# Altium schematic sheet usb-to-uart.SchDoc
size 420 x 297 mm; Address1: Address1; Address2: Address2; Address3: Address3; Address4: Address4; DocumentNumber: АБВГ.123456.001 Э3; SheetNumber: 1; Scale: 1:1; DocumentType: Схема электрическая принципиальная; FirstReferrence: АБВГ.123456.001
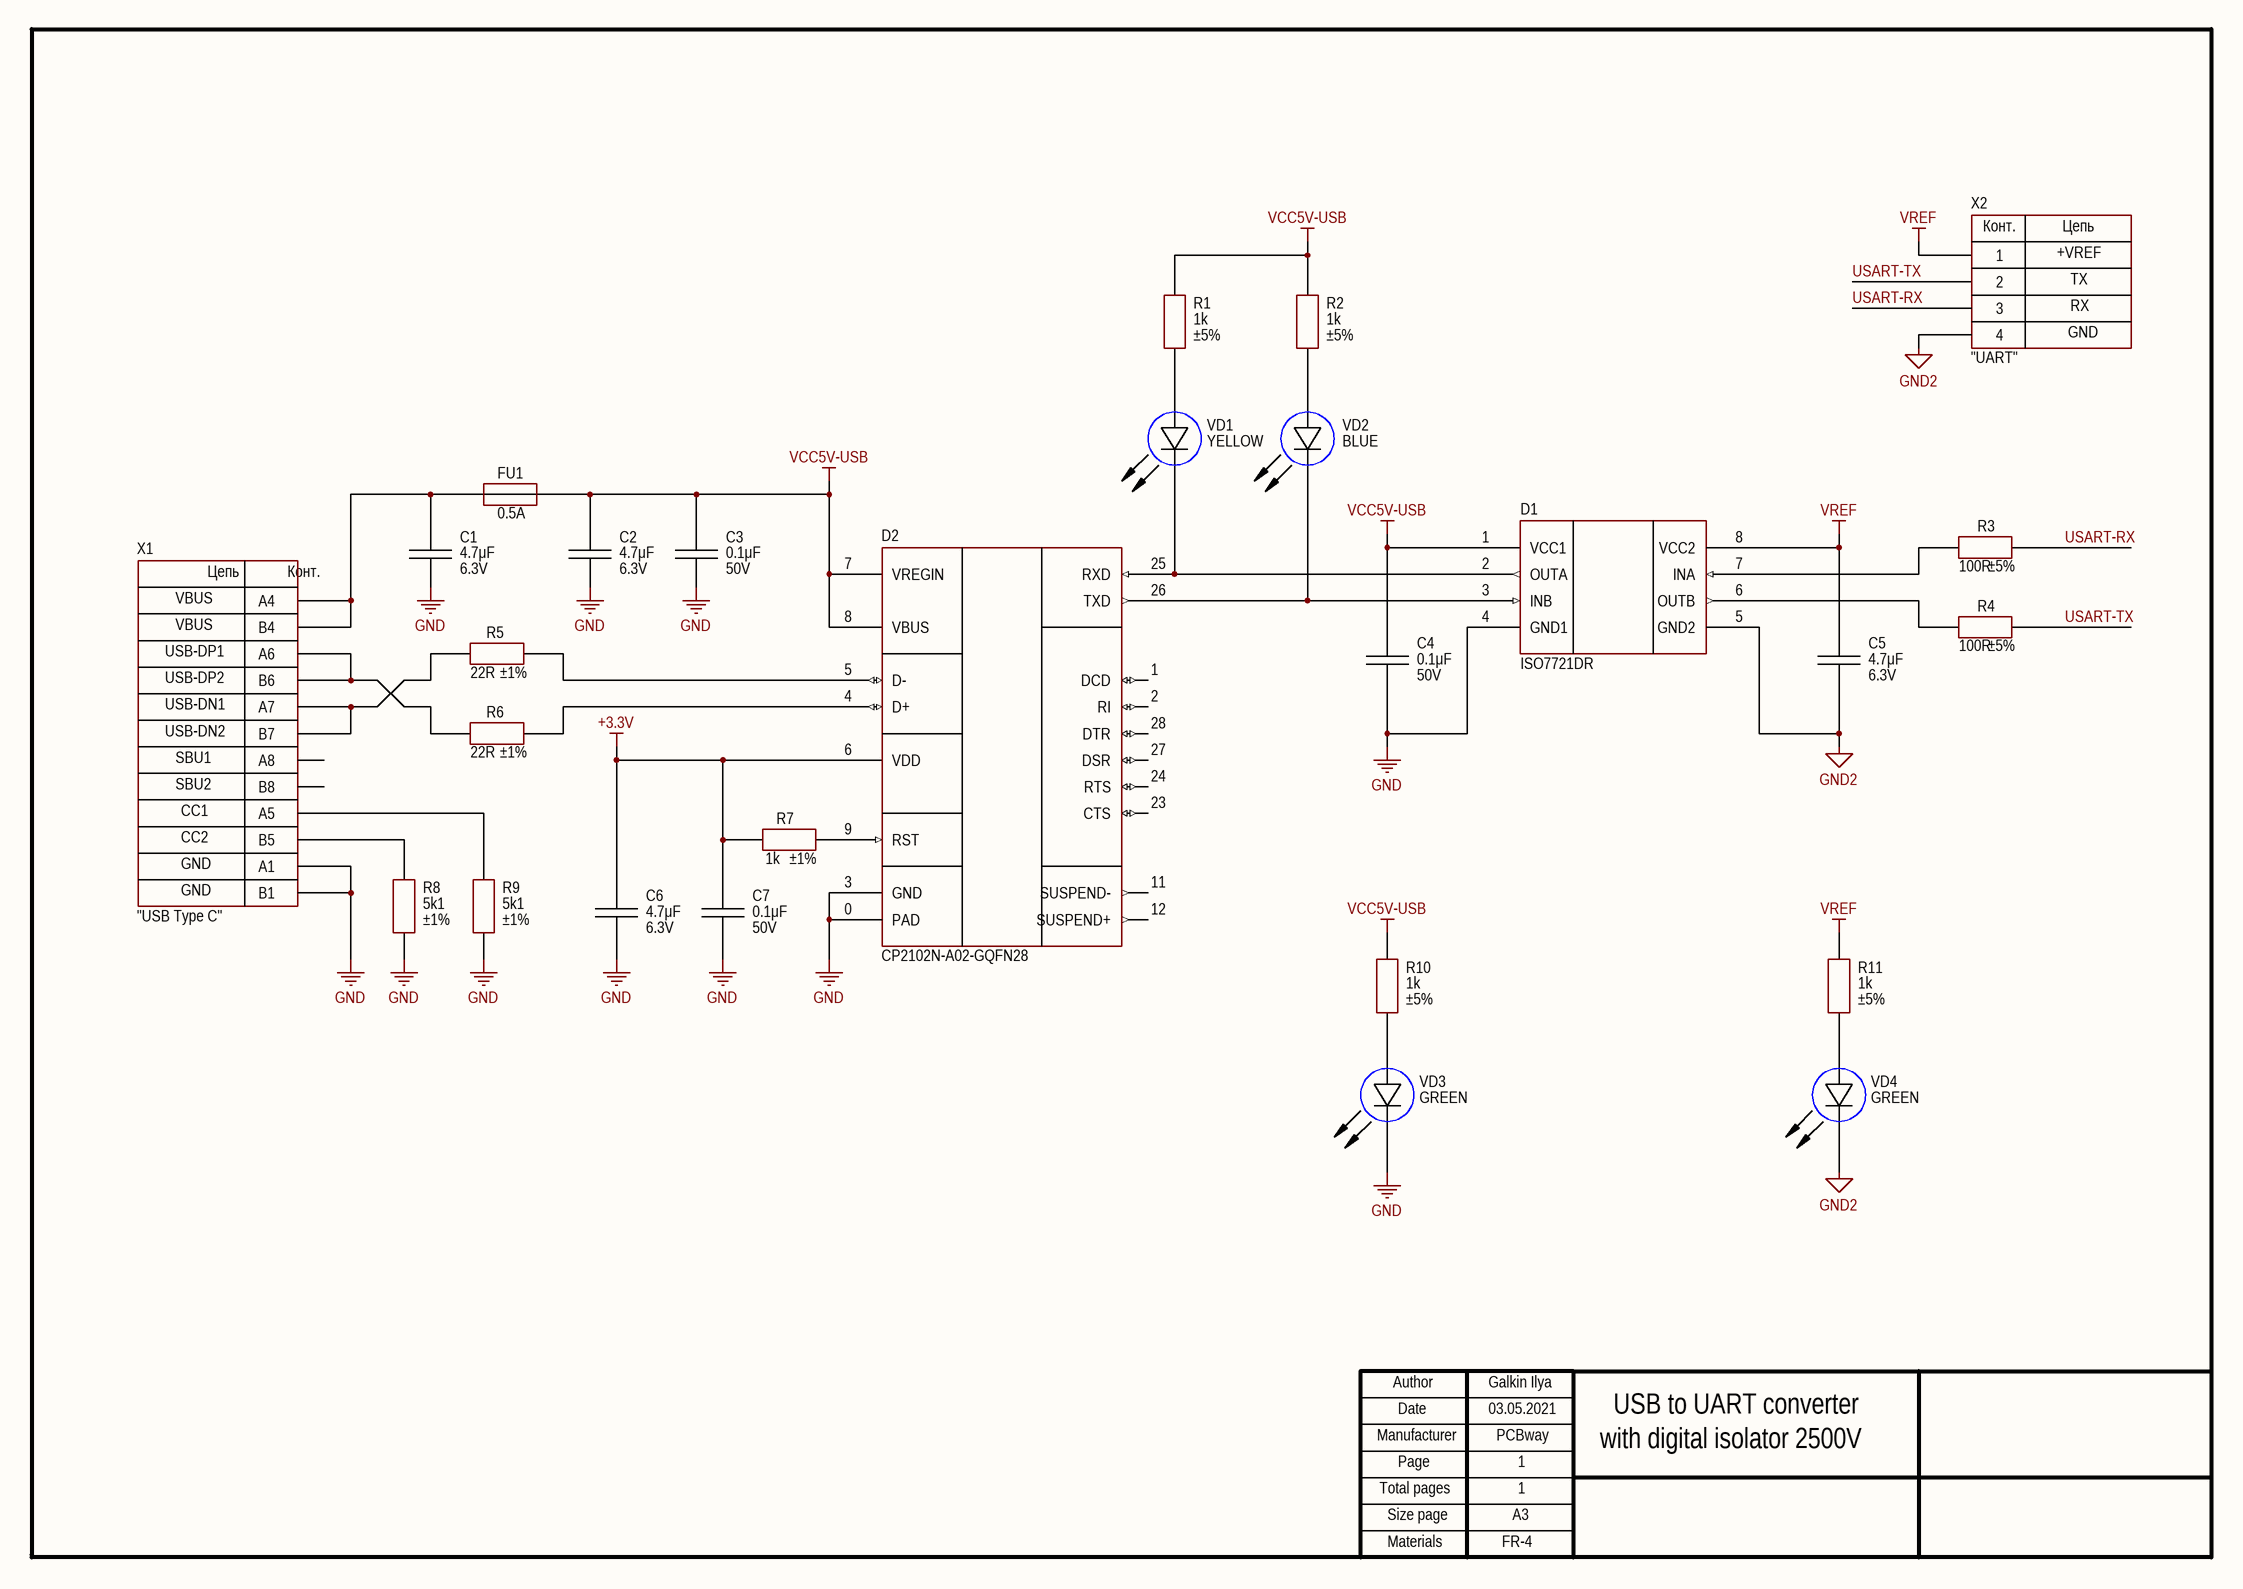
[diagram p0: usb-to-uart.SchDoc]

## Parts
C1  value 4.7μF  Voltage: 6.3V  [CAP: 0603]
C2  value 4.7μF  Voltage: 6.3V  [CAP: 0603]
C3  value 0.1μF  Voltage: 50V  [CAP: 0603]
C4  value 0.1μF  Voltage: 50V  [CAP: 0603]
C5  value 4.7μF  Voltage: 6.3V  [CAP: 0603]
C6  value 4.7μF  Voltage: 6.3V  [CAP: 0603]
C7  value 0.1μF  Voltage: 50V  [CAP: 0603]
D1  (no value)  [8-SOIC]
D2  PartNumber: CP2102N-A02-GQFN28  [28-QFN (5x5)]
FU1  MaxCurrent: 0.5A  [FUSE: 0603]
R1  value 1k  Tolerance: ±5%  [RES: 0603]
R2  value 1k  Tolerance: ±5%  [RES: 0603]
R3  value 100R  Tolerance: ±5%  [RES: 0603]
R4  value 100R  Tolerance: ±5%  [RES: 0603]
R5  value 22R  Tolerance: ±1%  [RES: 0603]
R6  value 22R  Tolerance: ±1%  [RES: 0603]
R7  value 1k  Tolerance: ±1%  [RES: 0603]
R8  value 5k1  Tolerance: ±1%  [RES: 0603]
R9  value 5k1  Tolerance: ±1%  [RES: 0603]
R10  value 1k  Tolerance: ±5%  [RES: 0603]
R11  value 1k  Tolerance: ±5%  [RES: 0603]
VD1  Color: YELLOW  [LED: 0603Y]
VD2  Color: BLUE  [LED: 0603B]
VD3  Color: GREEN  [LED: 0603G]
VD4  Color: GREEN  [LED: 0603G]
X1  CommentText: "USB Type C"  [CON: TYPE-C-31-M-12]
X2  CommentText: "UART"  [CON: PLS-4R]

## Nets
+3.3V: C6.2 C7.2 D2.6(VDD) R7.1
GND: C1.1 C2.1 C3.1 C4.1 C6.1 C7.1 D1.4(GND1) D2.0(PAD) D2.3(GND) R8.1 R9.1 VD3.2(C) X1.A1 X1.B1
GND2: C5.1 D1.5(GND2) VD4.2(C) X2.4
VCC5V-USB: C2.2 C3.2 C4.2 D1.1(VCC1) D2.7(VREGIN) D2.8(VBUS) FU1.2 R1.2 R2.2 R10.2
VREF: C5.2 D1.8(VCC2) R11.2 X2.1
USART-RX: R3.2 X2.3
USART-TX: R4.2 X2.2
NetC1_2: C1.2 FU1.1 X1.A4 X1.B4
NetD1_2: D1.2(OUTA) D2.25(RXD) VD1.2(C)
NetD1_3: D1.3(INB) D2.26(TXD) VD2.2(C)
NetD1_6: D1.6(OUTB) R4.1
NetD1_7: D1.7(INA) R3.1
NetD2_4: D2.4(D+) R6.1
NetD2_5: D2.5(D-) R5.1
NetD2_9: D2.9(RST) R7.2
NetR1_1: R1.1 VD1.1(A)
NetR2_1: R2.1 VD2.1(A)
NetR5_2: R5.2 X1.A7 X1.B7
NetR6_2: R6.2 X1.A6 X1.B6
NetR8_2: R8.2 X1.B5
NetR9_2: R9.2 X1.A5
NetR10_1: R10.1 VD3.1(A)
NetR11_1: R11.1 VD4.1(A)

Not connected (* = marked no-connect by the designer): D2 1(DCD) 2(RI) 11(SUSPEND-) 12(SUSPEND+) 23(CTS) 24(RTS) 27(DSR) 28(DTR); X1 A8 B8

## Notes on the sheet
- +VREF
- TX
- RX
- GND
- Galkin Ilya
- 03.05.2021
- PCBway
- 1
- with digital isolator 2500V
- USB to UART converter
- FR-4
- Author
- Manufacturer
- Date
- Page
- Total pages
- Size page
- A3
- Materials
- (in symbol Connector_USB_Type_C) Цепь; Конт.; VBUS; USB-DP1; USB-DP2; USB-DN1; USB-DN2; SBU1; SBU2; CC1; CC2; GND
- (in symbol PLS-4) Конт.; Цепь

## Library data of the parts
C1 C2 C5 C6 = Ceramic_0603: Manufacturer: Samsung; PartNumber: CL10B475KQ8NQNC; ValueManufacturerPartNumber: Ceramic capacitor, 4.7μF, X7R, ±10%, 6.3V, 0603, -55...+125°C; TypeCapacitor: Ceramic capacitor; Tolerance: ±10%; TypeDielectric: X7R; Package: 0603; HelpURL: https://www.digikey.com/product-detail/en/samsung-electro-mechanics/CL10B475KQ8NQNC/1276-2087-6-ND/3892601; Temperature: -55...+125°C
C3 C4 C7 = Ceramic_0603: Manufacturer: Samsung; PartNumber: CL10B104KB8NNNL; ValueManufacturerPartNumber: Ceramic capacitor, 0.1μF, X7R, ±10%, 50V, 0603, -55...+125°C; TypeCapacitor: Ceramic capacitor; Tolerance: ±10%; TypeDielectric: X7R; Package: 0603; HelpURL: https://www.digikey.com/product-detail/en/samsung-electro-mechanics/CL10B104KB8NNNL/1276-CL10B104KB8NNNLCT-ND/10320686; Temperature: -55...+125°C
D1 = ISO7721DR: Digital isolator 1/1; Manufacturer: Texas Instruments; ValueManufacturerPartNumber: IC digital isolator, 100Mbps, 3000Vrms, 2.25...5.5V, -55...+125°C, 8-SOIC; Supply: 2.25...5.5V; DataRate: 100Mbps; Isolation: 3000Vrms; HelpURL: https://www.digikey.com/product-detail/en/texas-instruments/ISO7721DR/296-48296-1-ND/8347715; Package: 8-SOIC; ComponentType: IC digital isolator; Temperature: -55...+125°C; PartNumber: ISO7721DR
D2 = CP2102N: USB-to-UART; Manufacturer: Silicon Labs; ValueManufacturerPartNumber: IC usb-to-uart bridge, USB2.0, 3...3.6V, -40...+85°C, 28-VFQFN; Supply: 3...3.6V; HelpURL: https://www.digikey.com/product-detail/en/silicon-labs/CP2102N-A02-GQFN28/336-5889-ND/9863477; Package: 28-VFQFN; ComponentType: IC usb-to-uart bridge; Temperature: -40...+85°C; Standard: USB2.0
FU1 = Fuse: Manufacturer: Eaton; PartNumber: TR-0603HV500-R; TypeFuse: Electromechanics relay; VoltageMax: 63VDC; Package: case 0603; HelpURL: https://www.digikey.com/en/products/detail/eaton-electronics-division/TR-0603HV500-R/11491664; ValueManufacturerPartNumber: =TypeFuse+', '+VoltageMax+', '+MaxCurrent+', '+Package+', '+Temperature
R1 R2 R10 R11 = Resistor_0603: Manufacturer: Yageo; PartNumber: RC0603JR-071KL; ValueManufacturerPartNumber: Resistor film, 1k, ±5%, 0603, 0.1W, -55...+125°C; TypeResistor: Resistor film; Power: 0.1W; Package: 0603; HelpURL: https://www.digikey.com/product-detail/en/yageo/RC0603JR-071KL/311-1.0KGRCT-ND/729624; Temperature: -55...+125°C
R3 R4 = Resistor_0603: Manufacturer: Yageo; PartNumber: RC0603JR-07100RL; ValueManufacturerPartNumber: Resistor film, 100R, ±5%, 0603, 0.1W, -55...+125°C; TypeResistor: Resistor film; Power: 0.1W; Package: 0603; HelpURL: https://www.digikey.com/product-detail/en/yageo/RC0603JR-07100RL/311-100GRCT-ND/729644; Temperature: -55...+125°C
R5 R6 = Resistor_0603: Manufacturer: Yageo; PartNumber: RC0603FR-0722RL; ValueManufacturerPartNumber: Resistor film, 22R, ±1%, 0603, 0.1W, -55...+125°C; TypeResistor: Resistor film; Power: 0.1W; Package: 0603; HelpURL: https://www.digikey.com/product-detail/en/yageo/RC0603FR-0722RL/311-22-0HRCT-ND/730002; Temperature: -55...+125°C
R7 = Resistor_0603: Manufacturer: Yageo; PartNumber: RC0603FR-071KL; ValueManufacturerPartNumber: Resistor film, 1k, ±1%, 0603, 0.1W, -55...+125°C; TypeResistor: Resistor film; Power: 0.1W; Package: 0603; HelpURL: https://www.digikey.com/product-detail/en/yageo/RC0603FR-071KL/311-1-00KHRCT-ND/729790; Temperature: -55...+125°C
R8 R9 = Resistor_0603: Manufacturer: Yageo; PartNumber: RC0603FR-075K1L; ValueManufacturerPartNumber: Resistor film, 5k1, ±1%, 0603, 0.1W, -55...+125°C; TypeResistor: Resistor film; Power: 0.1W; Package: 0603; HelpURL: https://www.digikey.com/product-detail/en/yageo/RC0603FR-075K1L/311-5-10KHRCT-ND/730215; Temperature: -55...+125°C
VD1 = LED_single: Manufacturer: Wurth; ValueManufacturerPartNumber: LED, 20mA, 2V, 0603, -55...+150°C; PartNumber: 150060YS75000; TypeDiode: LED; Current: 20mA; VoltageDrop: 2V; Package: 0603; HelpURL: https://www.digikey.com/product-detail/en/wurth-electronics-inc/150060YS75000/732-4981-1-ND/4489907; Temperature: -55...+150°C
VD2 = LED_single: Manufacturer: Wurth; ValueManufacturerPartNumber: LED, 20mA, 3.2V, 0603, -55...+150°C; PartNumber: 150060BS75000; TypeDiode: LED; Current: 20mA; VoltageDrop: 3.2V; Package: 0603; HelpURL: https://www.digikey.com/product-detail/en/wurth-electronics-inc/150060BS75000/732-4966-1-ND/4489893; Temperature: -55...+150°C
VD3 VD4 = LED_single: Manufacturer: Wurth; ValueManufacturerPartNumber: LED, 20mA, 2V, 0603, -55...+150°C; PartNumber: 150060VS75000; TypeDiode: LED; Current: 20mA; VoltageDrop: 2V; Package: 0603; HelpURL: https://www.digikey.com/product-detail/en/wurth-electronics-inc/150060VS75000/732-4980-1-ND/4489904; Temperature: -55...+150°C
X1 = Connector_USB_Type_C: Manufacturer: Korean Hroparts; ValueManufacturerPartNumber: USB Type C, 3A; PartNumber: TYPE-C-31-M-12; TypeConnector: USB Type C; CurrentMax: 3A; HelpURL: https://lcsc.com/product-detail/USB-Type-C_Korean-Hroparts-Elec-TYPE-C-31-M-12_C165948.html
X2 = PLS-4: Manufacturer: Connfly; ValueManufacturerPartNumber: Connector, 4pin, 2.54mm, 500VAC, 3A; PartNumber: PLS-4R; TypeConnector: Connector; VoltageMax: 500VAC; Pitch: 2.54mm; CurrentMax: 3A; Multichannel: 4pin; HelpURL: https://www.chipdip.ru/product/pls-4r